# Altium schematic sheet TAXM8M4RDBCCT2T1_TAXM8M4RDBCCT2T.schdoc
size 127 x 99 mm
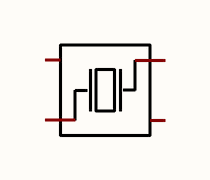
[diagram p0: TAXM8M4RDBCCT2T1_TAXM8M4RDBCCT2T.schdoc]

## Parts
X?  8MHz  [OSC-SMD_4P-L3.2-W2.5-BL]  (value not drawn)

## Nets

Not connected (* = marked no-connect by the designer): X? 1 2 3 4

## Library data of the parts
X? = TAXM8M4RDBCCT2T: Manufacturer: YJX(雅晶鑫); Add into BOM: yes; Crystal Type: 贴片晶振; Normal temperature Frequency Tolerance: ±10ppm; External load capacitor: 10pF; Frequency Stability(Full temperature range): ±15ppm; Equivalent Series Resistance (ESR): 250Ω; Symbol: TAXM8M4RDBCCT2T; Device: TAXM8M4RDBCCT2T; LCSC Part Name: 8MHz ±10ppm 10pF; Supplier Part: C400090; Manufacturer Part: TAXM8M4RDBCCT2T; Supplier Footprint: SMD3225-4P; JLCPCB Part Class: Extended Part; Datasheet: https://atta.szlcsc.com/upload/public/pdf/source/20190626/C400090_CF95B89E745AFE4EF2E392EF8AC009D6.pdf; Supplier: LCSC; Convert to PCB: yes; Value: 8MHz; Operating Temperature: -40℃~+85℃